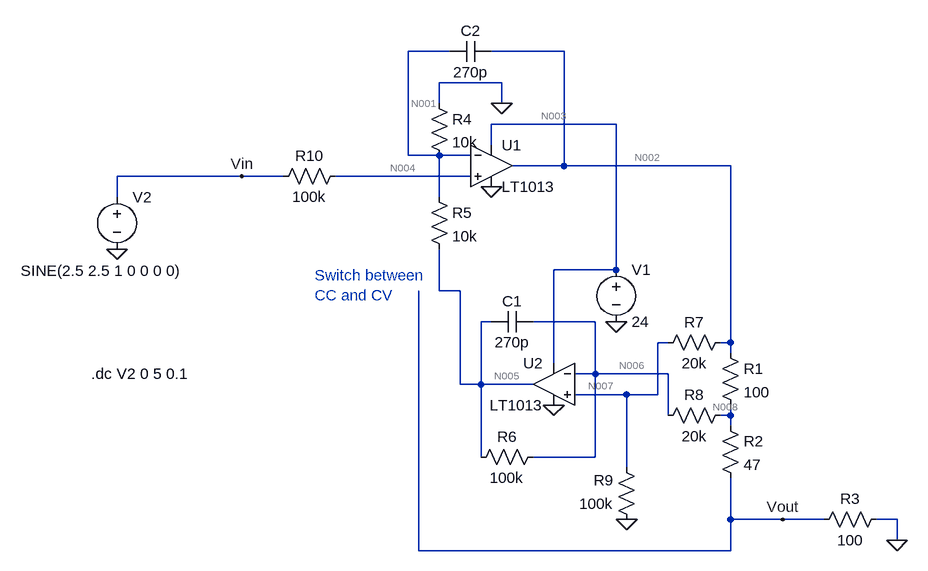
[diagram p0: schematic analog_out.asc]
analog_out.asc, the LTspice schematic file:
Version 4
SHEET 1 888 712
WIRE 144 -80 80 -80
WIRE 320 -80 208 -80
WIRE 224 -32 128 -32
WIRE 128 0 128 -32
WIRE 224 0 224 -32
WIRE 400 32 208 32
WIRE 208 64 208 32
WIRE 80 80 80 -80
WIRE 128 80 80 80
WIRE 176 80 128 80
WIRE 320 96 320 -80
WIRE 320 96 240 96
WIRE 576 96 320 96
WIRE -176 112 -368 112
WIRE -112 112 -176 112
WIRE 176 112 -32 112
WIRE -368 144 -368 112
WIRE 128 144 128 80
WIRE 400 256 400 32
WIRE 400 256 304 256
WIRE 128 288 128 224
WIRE 160 288 128 288
WIRE 208 336 192 336
WIRE 368 336 272 336
WIRE 480 368 464 368
WIRE 576 368 576 96
WIRE 576 368 560 368
WIRE 576 384 576 368
WIRE 304 400 304 256
WIRE 368 416 368 336
WIRE 368 416 336 416
WIRE 480 416 368 416
WIRE 160 432 160 288
WIRE 192 432 192 336
WIRE 192 432 160 432
WIRE 272 432 192 432
WIRE 416 448 336 448
WIRE 464 448 464 368
WIRE 464 448 416 448
WIRE 480 480 480 416
WIRE 576 480 576 464
WIRE 576 480 560 480
WIRE 576 496 576 480
WIRE 192 544 192 432
WIRE 368 544 368 416
WIRE 368 544 272 544
WIRE 416 560 416 448
WIRE 576 640 576 576
WIRE 656 640 576 640
WIRE 720 640 656 640
WIRE 832 640 800 640
WIRE 832 672 832 640
WIRE 96 688 96 288
WIRE 576 688 576 640
WIRE 576 688 96 688
FLAG 400 336 0
FLAG 208 128 0
FLAG 304 464 0
FLAG 832 672 0
FLAG -368 224 0
FLAG 224 0 0
FLAG 416 640 0
FLAG -176 112 Vin
FLAG 656 640 Vout
SYMBOL OpAmps\\LT1013 208 32 R0
SYMATTR InstName U1
SYMBOL OpAmps\\LT1013 304 368 M0
SYMATTR InstName U2
SYMBOL voltage 400 240 R0
WINDOW 123 0 0 Left 0
WINDOW 39 0 0 Left 0
SYMATTR InstName V1
SYMATTR Value 24
SYMBOL res 560 368 R0
SYMATTR InstName R1
SYMATTR Value 100
SYMBOL res 560 480 R0
SYMATTR InstName R2
SYMATTR Value 47
SYMBOL res 816 624 R90
WINDOW 0 0 56 VBottom 2
WINDOW 3 32 56 VTop 2
SYMATTR InstName R3
SYMATTR Value 100
SYMBOL voltage -368 128 R0
WINDOW 3 -148 129 Left 2
WINDOW 123 0 0 Left 0
WINDOW 39 0 0 Left 0
SYMATTR Value SINE(2.5 2.5 1 0 0 0 0)
SYMATTR InstName V2
SYMBOL res 112 -16 R0
SYMATTR InstName R4
SYMATTR Value 10k
SYMBOL res 112 128 R0
SYMATTR InstName R5
SYMATTR Value 10k
SYMBOL res 288 528 R90
WINDOW 0 0 56 VBottom 2
WINDOW 3 32 56 VTop 2
SYMATTR InstName R6
SYMATTR Value 100k
SYMBOL res 576 352 R90
WINDOW 0 0 56 VBottom 2
WINDOW 3 32 56 VTop 2
SYMATTR InstName R7
SYMATTR Value 20k
SYMBOL res 576 464 R90
WINDOW 0 0 56 VBottom 2
WINDOW 3 32 56 VTop 2
SYMATTR InstName R8
SYMATTR Value 20k
SYMBOL res 432 656 R180
WINDOW 0 36 76 Left 2
WINDOW 3 36 40 Left 2
SYMATTR InstName R9
SYMATTR Value 100k
SYMBOL res -16 96 R90
WINDOW 0 0 56 VBottom 2
WINDOW 3 32 56 VTop 2
SYMATTR InstName R10
SYMATTR Value 100k
SYMBOL cap 272 320 R90
WINDOW 0 0 32 VBottom 2
WINDOW 3 32 32 VTop 2
SYMATTR InstName C1
SYMATTR Value 270p
SYMBOL cap 208 -96 R90
WINDOW 0 0 32 VBottom 2
WINDOW 3 32 32 VTop 2
SYMATTR InstName C2
SYMATTR Value 270p
TEXT -64 264 Left 2 ;Switch between \nCC and CV
TEXT -408 416 Left 2 !.dc V2 0 5 0.1

The netlist it stands for:
* analog_out.asc
XU1 N004 N001 N003 0 N002 LT1013  ; pins In+ In- V+ V- OUT
XU2 N007 N006 N003 0 N005 LT1013  ; pins In+ In- V+ V- OUT
V1 N003 0 24
R1 N002 N008 100
R2 N008 Vout 47
R3 0 Vout 100
V2 Vin 0 SINE(2.5 2.5 1 0 0 0 0)
R4 0 N001 10k
R5 N001 N005 10k
R6 N006 N005 100k
R7 N002 N007 20k
R8 N008 N006 20k
R9 0 N007 100k
R10 N004 Vin 100k
C1 N006 N005 270p
C2 N002 N001 270p
* Switch between
* CC and CV
.dc V2 0 5 0.1
.lib LTC.lib
.backanno
.end

* Results of the author's LTspice run, read from the files saved beside the schematic
* Operating Point, zero values left out:
*   V(n001) = 2.501 V
*   V(n004) = 2.501 V
*   V(n003) = 24 V
*   V(n002) = 2.476 V
*   V(n006) = 2.063 V
*   V(n007) = 2.063 V
*   V(n005) = 5.002 V
*   V(n008) = 1.475 V
*   V(vout) = 1.003 V
*   V(vin) = 2.5 V
*   I(R10) = 12.95 nA
*   I(R9) = -20.63 µA
*   I(R8) = -29.41 µA
*   I(R7) = 20.62 µA
*   I(R6) = -29.39 µA
*   I(R5) = -250.1 µA
*   I(R4) = -250.1 µA
*   I(R3) = -10.03 mA
*   I(R2) = 10.03 mA
*   I(R1) = 10 mA
*   I(V2) = 12.95 nA
*   I(V1) = -10.53 mA
*   Ix(u1:1) = -12.95 nA
*   Ix(u1:2) = -12.95 nA
*   Ix(u1:3) = 10.03 mA
*   Ix(u1:4) = -281.7 pA
*   Ix(u1:5) = -10.03 mA
*   Ix(u2:1) = -12.99 nA
*   Ix(u2:2) = -12.99 nA
*   Ix(u2:3) = 503.7 µA
*   Ix(u2:4) = -224.2 µA
*   Ix(u2:5) = -279.5 µA
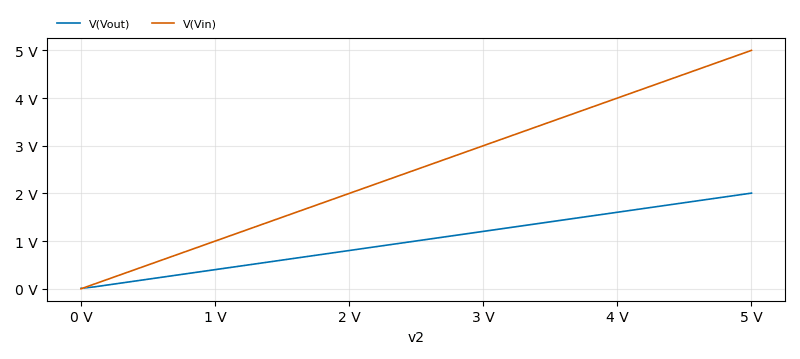
[diagram p1: DC transfer characteristic of analog_out.asc, plotted from the saved traces]
* DC transfer characteristic, 1 run:
*   V(Vout): 9.756 mV at v2=0 V, 2.006 V at v2=5 V, min 9.756 mV, max 2.006 V
*   V(Vin): 0 V at v2=0 V, 5 V at v2=5 V, min 0 V, max 5 V